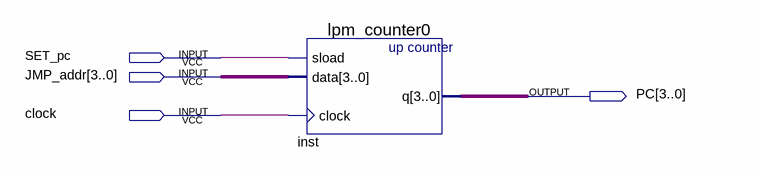
[diagram p0: schematic sheet]
// Quartus schematic counterTest.bdf as structural Verilog: 1 symbols, 4 pins
module counterTest (
  input  SET_pc,
  input  [3:0] JMP_addr,
  input  clock,
  output [3:0] PC
);

  lpm_counter0 inst (.sload(SET_pc), .data(JMP_addr), .clock(clock), .q(PC));
endmodule
